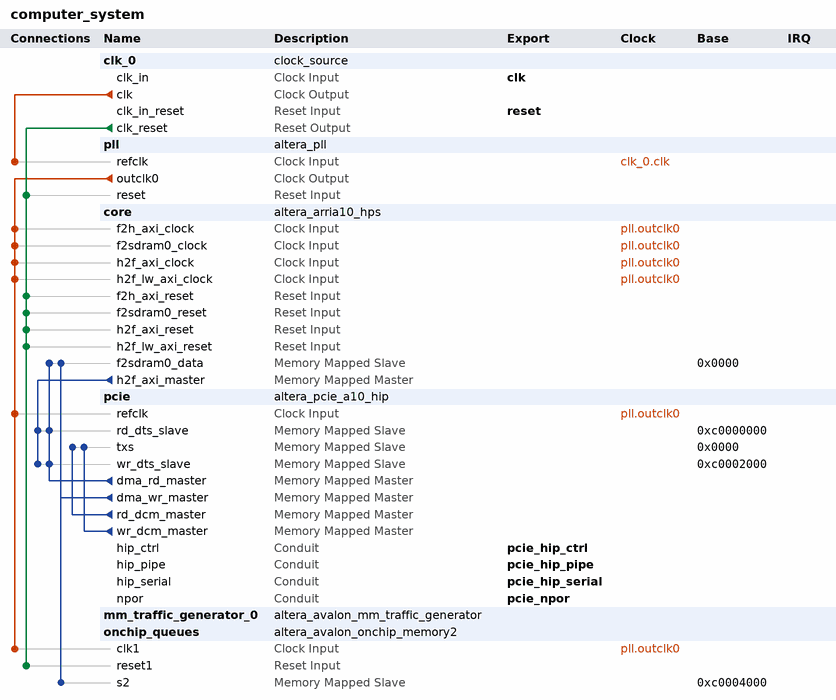
[diagram p0: system contents]
# Platform Designer (Qsys) system computer_system, Cyclone V 5CEBA2F17A7
# Parameters at their usual value, and those the tool derives, are not listed.
package require -exact qsys 21.1
create_system computer_system
set_project_property DEVICE_FAMILY {Cyclone V}
set_project_property DEVICE 5CEBA2F17A7

add_instance clk_0 clock_source 21.1
set_instance_parameter_value clk_0 clockFrequency 50000000

add_instance pll altera_pll 21.1
set_instance_parameter_value pll gui_device_speed_grade 1
set_instance_parameter_value pll gui_number_of_clocks 1
set_instance_parameter_value pll gui_operation_mode direct
set_instance_parameter_value pll gui_output_clock_frequency0 250.0
set_instance_parameter_value pll gui_pll_mode {Integer-N PLL}
set_instance_parameter_value pll gui_reference_clock_frequency 50.0
set_instance_parameter_value pll gui_use_locked false

add_instance core altera_arria10_hps 21.1
set_instance_parameter_value core BOOT_FROM_FPGA_Enable false
set_instance_parameter_value core BSEL 1
set_instance_parameter_value core BSEL_EN false
set_instance_parameter_value core CLK_EMACA_SOURCE 1
set_instance_parameter_value core CLK_EMACB_SOURCE 1
set_instance_parameter_value core CLK_EMAC_PTP_SOURCE 1
set_instance_parameter_value core CLK_GPIO_SOURCE 1
set_instance_parameter_value core CLK_HMC_PLL_SOURCE 0
set_instance_parameter_value core CLK_MAIN_PLL_SOURCE2 0
set_instance_parameter_value core CLK_MPU_CNT 0
set_instance_parameter_value core CLK_MPU_SOURCE 0
set_instance_parameter_value core CLK_NOC_CNT 0
set_instance_parameter_value core CLK_NOC_SOURCE 0
set_instance_parameter_value core CLK_PERI_PLL_SOURCE2 0
set_instance_parameter_value core CLK_S2F_USER0_SOURCE 0
set_instance_parameter_value core CLK_S2F_USER1_SOURCE 0
set_instance_parameter_value core CLK_SDMMC_SOURCE 0
set_instance_parameter_value core CM_Mode N/A
set_instance_parameter_value core CM_PinMuxing Unused
set_instance_parameter_value core CTI_Enable false
set_instance_parameter_value core CUSTOM_MPU_CLK 800
set_instance_parameter_value core DEBUG_APB_Enable false
set_instance_parameter_value core DISABLE_PERI_PLL false
set_instance_parameter_value core DMA_Enable No,No,No,No,No,No,No,No
set_instance_parameter_value core EMAC0_CLK 250
set_instance_parameter_value core EMAC0_Mode N/A
set_instance_parameter_value core EMAC0_PTP false
set_instance_parameter_value core EMAC0_PinMuxing Unused
set_instance_parameter_value core EMAC0_SWITCH_Enable false
set_instance_parameter_value core EMAC1_CLK 250
set_instance_parameter_value core EMAC1_Mode N/A
set_instance_parameter_value core EMAC1_PTP false
set_instance_parameter_value core EMAC1_PinMuxing Unused
set_instance_parameter_value core EMAC1_SWITCH_Enable false
set_instance_parameter_value core EMAC2_CLK 250
set_instance_parameter_value core EMAC2_Mode N/A
set_instance_parameter_value core EMAC2_PTP false
set_instance_parameter_value core EMAC2_PinMuxing Unused
set_instance_parameter_value core EMAC2_SWITCH_Enable false
set_instance_parameter_value core EMAC_PTP_REF_CLK 100
set_instance_parameter_value core EMIF_BYPASS_CHECK false
set_instance_parameter_value core EMIF_CONDUIT_Enable true
set_instance_parameter_value core F2H_AXI_CLOCK_FREQ 250000000
set_instance_parameter_value core F2H_COLD_RST_Enable false
set_instance_parameter_value core F2H_DBG_RST_Enable false
set_instance_parameter_value core F2H_FREE_CLK_Enable false
set_instance_parameter_value core F2H_FREE_CLK_FREQ 200
set_instance_parameter_value core F2H_SDRAM0_CLOCK_FREQ 100
set_instance_parameter_value core F2H_SDRAM1_CLOCK_FREQ 100
set_instance_parameter_value core F2H_SDRAM2_CLOCK_FREQ 100
set_instance_parameter_value core F2H_SDRAM3_CLOCK_FREQ 100
set_instance_parameter_value core F2H_SDRAM4_CLOCK_FREQ 100
set_instance_parameter_value core F2H_SDRAM5_CLOCK_FREQ 100
set_instance_parameter_value core F2H_WARM_RST_Enable false
set_instance_parameter_value core F2SDRAM0_ENABLED true
set_instance_parameter_value core F2SDRAM1_ENABLED false
set_instance_parameter_value core F2SDRAM2_DELAY 4
set_instance_parameter_value core F2SDRAM2_ENABLED false
set_instance_parameter_value core F2SDRAM_ADDRESS_WIDTH 32
set_instance_parameter_value core F2SDRAM_PORT_CONFIG 5
set_instance_parameter_value core F2SDRAM_READY_LATENCY true
set_instance_parameter_value core F2SINTERRUPT_Enable true
set_instance_parameter_value core F2S_Width 5
set_instance_parameter_value core FPGA_PERIPHERAL_INPUT_CLOCK_FREQ_EMAC0_RX_CLK_IN 100
set_instance_parameter_value core FPGA_PERIPHERAL_INPUT_CLOCK_FREQ_EMAC0_TX_CLK_IN 100
set_instance_parameter_value core FPGA_PERIPHERAL_INPUT_CLOCK_FREQ_EMAC1_RX_CLK_IN 100
set_instance_parameter_value core FPGA_PERIPHERAL_INPUT_CLOCK_FREQ_EMAC1_TX_CLK_IN 100
set_instance_parameter_value core FPGA_PERIPHERAL_INPUT_CLOCK_FREQ_EMAC2_RX_CLK_IN 100
set_instance_parameter_value core FPGA_PERIPHERAL_INPUT_CLOCK_FREQ_EMAC2_TX_CLK_IN 100
set_instance_parameter_value core FPGA_PERIPHERAL_INPUT_CLOCK_FREQ_EMAC_PTP_REF_CLOCK 100
set_instance_parameter_value core FPGA_PERIPHERAL_INPUT_CLOCK_FREQ_I2C0_SCL_IN 100
set_instance_parameter_value core FPGA_PERIPHERAL_INPUT_CLOCK_FREQ_I2C1_SCL_IN 100
set_instance_parameter_value core FPGA_PERIPHERAL_INPUT_CLOCK_FREQ_I2CEMAC0_SCL_IN 100
set_instance_parameter_value core FPGA_PERIPHERAL_INPUT_CLOCK_FREQ_I2CEMAC1_SCL_IN 100
set_instance_parameter_value core FPGA_PERIPHERAL_INPUT_CLOCK_FREQ_I2CEMAC2_SCL_IN 100
set_instance_parameter_value core FPGA_PERIPHERAL_INPUT_CLOCK_FREQ_SDMMC_CLK_IN 100
set_instance_parameter_value core FPGA_PERIPHERAL_INPUT_CLOCK_FREQ_SPIS0_SCLK_IN 100
set_instance_parameter_value core FPGA_PERIPHERAL_INPUT_CLOCK_FREQ_SPIS1_SCLK_IN 100
set_instance_parameter_value core FPGA_PERIPHERAL_INPUT_CLOCK_FREQ_USB0_CLK_IN 100
set_instance_parameter_value core FPGA_PERIPHERAL_INPUT_CLOCK_FREQ_USB1_CLK_IN 100
set_instance_parameter_value core FPGA_PERIPHERAL_OUTPUT_CLOCK_FREQ_EMAC0_GTX_CLK 100
set_instance_parameter_value core FPGA_PERIPHERAL_OUTPUT_CLOCK_FREQ_EMAC0_MD_CLK 2.5
set_instance_parameter_value core FPGA_PERIPHERAL_OUTPUT_CLOCK_FREQ_EMAC1_GTX_CLK 100
set_instance_parameter_value core FPGA_PERIPHERAL_OUTPUT_CLOCK_FREQ_EMAC1_MD_CLK 2.5
set_instance_parameter_value core FPGA_PERIPHERAL_OUTPUT_CLOCK_FREQ_EMAC2_GTX_CLK 100
set_instance_parameter_value core FPGA_PERIPHERAL_OUTPUT_CLOCK_FREQ_EMAC2_MD_CLK 2.5
set_instance_parameter_value core FPGA_PERIPHERAL_OUTPUT_CLOCK_FREQ_I2C0_CLK 100
set_instance_parameter_value core FPGA_PERIPHERAL_OUTPUT_CLOCK_FREQ_I2C1_CLK 100
set_instance_parameter_value core FPGA_PERIPHERAL_OUTPUT_CLOCK_FREQ_I2CEMAC0_CLK 100
set_instance_parameter_value core FPGA_PERIPHERAL_OUTPUT_CLOCK_FREQ_I2CEMAC1_CLK 100
set_instance_parameter_value core FPGA_PERIPHERAL_OUTPUT_CLOCK_FREQ_I2CEMAC2_CLK 100
set_instance_parameter_value core FPGA_PERIPHERAL_OUTPUT_CLOCK_FREQ_QSPI_SCLK_OUT 100
set_instance_parameter_value core FPGA_PERIPHERAL_OUTPUT_CLOCK_FREQ_SDMMC_CCLK 100
set_instance_parameter_value core FPGA_PERIPHERAL_OUTPUT_CLOCK_FREQ_SPIM0_SCLK_OUT 100
set_instance_parameter_value core FPGA_PERIPHERAL_OUTPUT_CLOCK_FREQ_SPIM1_SCLK_OUT 100
set_instance_parameter_value core GPIO_REF_CLK 4
set_instance_parameter_value core GP_Enable false
set_instance_parameter_value core H2F_AXI_CLOCK_FREQ 250000000
set_instance_parameter_value core H2F_COLD_RST_Enable false
set_instance_parameter_value core H2F_CTI_CLOCK_FREQ 100
set_instance_parameter_value core H2F_DEBUG_APB_CLOCK_FREQ 100
set_instance_parameter_value core H2F_LW_AXI_CLOCK_FREQ 250000000
set_instance_parameter_value core H2F_PENDING_RST_Enable false
set_instance_parameter_value core H2F_TPIU_CLOCK_IN_FREQ 100
set_instance_parameter_value core H2F_USER0_CLK_Enable false
set_instance_parameter_value core H2F_USER0_CLK_FREQ 400
set_instance_parameter_value core H2F_USER1_CLK_Enable false
set_instance_parameter_value core H2F_USER1_CLK_FREQ 400
set_instance_parameter_value core HMC_PLL_REF_CLK 800
set_instance_parameter_value core HPS_DIV_GPIO_FREQ 125
set_instance_parameter_value core HPS_IO_Enable unused,unused,unused,unused,unused,unused,unused,unused,unused,unused,unused,unused,unused,unused,unused,unused,unused,unused,unused,unused,unused,unused,unused,unused,unused,unused,unused,unused,unused,unused,unused,unused,unused,unused,unused,unused,unused,unused,unused,unused,unused,unused,unused,unused,unused,unused,unused,unused,unused,unused,unused,unused,unused,unused,unused,unused,unused,unused,unused,unused,unused,unused
set_instance_parameter_value core I2C0_Mode N/A
set_instance_parameter_value core I2C0_PinMuxing Unused
set_instance_parameter_value core I2C1_Mode N/A
set_instance_parameter_value core I2C1_PinMuxing Unused
set_instance_parameter_value core I2CEMAC0_Mode N/A
set_instance_parameter_value core I2CEMAC0_PinMuxing Unused
set_instance_parameter_value core I2CEMAC1_Mode N/A
set_instance_parameter_value core I2CEMAC1_PinMuxing Unused
set_instance_parameter_value core I2CEMAC2_Mode N/A
set_instance_parameter_value core I2CEMAC2_PinMuxing Unused
set_instance_parameter_value core INTERNAL_OSCILLATOR_ENABLE 60
set_instance_parameter_value core JTAG_Enable false
set_instance_parameter_value core L3_MAIN_FREE_CLK 400
set_instance_parameter_value core L4_SYS_FREE_CLK 1
set_instance_parameter_value core LWH2F_Enable 2
set_instance_parameter_value core MPU_CLK_VCCL 0
set_instance_parameter_value core MPU_EVENTS_Enable true
set_instance_parameter_value core NAND_Mode N/A
set_instance_parameter_value core NAND_PinMuxing Unused
set_instance_parameter_value core NOCDIV_CS_ATCLK 0
set_instance_parameter_value core NOCDIV_CS_PDBGCLK 1
set_instance_parameter_value core NOCDIV_CS_TRACECLK 0
set_instance_parameter_value core NOCDIV_L4MAINCLK 0
set_instance_parameter_value core NOCDIV_L4MPCLK 1
set_instance_parameter_value core NOCDIV_L4SPCLK 2
set_instance_parameter_value core OVERIDE_PERI_PLL false
set_instance_parameter_value core PERI_PLL_MANUAL_VCO_FREQ 2000
set_instance_parameter_value core PLL_CLK0 Unused
set_instance_parameter_value core PLL_CLK1 Unused
set_instance_parameter_value core PLL_CLK2 Unused
set_instance_parameter_value core PLL_CLK3 Unused
set_instance_parameter_value core PLL_CLK4 Unused
set_instance_parameter_value core QSPI_Mode N/A
set_instance_parameter_value core QSPI_PinMuxing Unused
set_instance_parameter_value core RUN_INTERNAL_BUILD_CHECKS 0
set_instance_parameter_value core S2FINTERRUPT_CLOCKPERIPHERAL_Enable false
set_instance_parameter_value core S2FINTERRUPT_CTI_Enable false
set_instance_parameter_value core S2FINTERRUPT_DMA_Enable false
set_instance_parameter_value core S2FINTERRUPT_EMAC0_Enable false
set_instance_parameter_value core S2FINTERRUPT_EMAC1_Enable false
set_instance_parameter_value core S2FINTERRUPT_EMAC2_Enable false
set_instance_parameter_value core S2FINTERRUPT_FPGAMANAGER_Enable false
set_instance_parameter_value core S2FINTERRUPT_GPIO_Enable false
set_instance_parameter_value core S2FINTERRUPT_HMC_Enable false
set_instance_parameter_value core S2FINTERRUPT_I2C0_Enable false
set_instance_parameter_value core S2FINTERRUPT_I2C1_Enable false
set_instance_parameter_value core S2FINTERRUPT_I2CEMAC0_Enable false
set_instance_parameter_value core S2FINTERRUPT_I2CEMAC1_Enable false
set_instance_parameter_value core S2FINTERRUPT_I2CEMAC2_Enable false
set_instance_parameter_value core S2FINTERRUPT_L4TIMER_Enable false
set_instance_parameter_value core S2FINTERRUPT_NAND_Enable false
set_instance_parameter_value core S2FINTERRUPT_QSPI_Enable false
set_instance_parameter_value core S2FINTERRUPT_SDMMC_Enable false
set_instance_parameter_value core S2FINTERRUPT_SPIM0_Enable false
set_instance_parameter_value core S2FINTERRUPT_SPIM1_Enable false
set_instance_parameter_value core S2FINTERRUPT_SPIS0_Enable false
set_instance_parameter_value core S2FINTERRUPT_SPIS1_Enable false
set_instance_parameter_value core S2FINTERRUPT_SYSTEMMANAGER_Enable false
set_instance_parameter_value core S2FINTERRUPT_SYSTIMER_Enable false
set_instance_parameter_value core S2FINTERRUPT_UART0_Enable false
set_instance_parameter_value core S2FINTERRUPT_UART1_Enable false
set_instance_parameter_value core S2FINTERRUPT_USB0_Enable false
set_instance_parameter_value core S2FINTERRUPT_USB1_Enable false
set_instance_parameter_value core S2FINTERRUPT_WATCHDOG_Enable false
set_instance_parameter_value core S2F_Width 5
set_instance_parameter_value core SDMMC_Mode N/A
set_instance_parameter_value core SDMMC_PinMuxing Unused
set_instance_parameter_value core SDMMC_REF_CLK 200
set_instance_parameter_value core SECURITY_MODULE_Enable false
set_instance_parameter_value core SPIM0_Mode N/A
set_instance_parameter_value core SPIM0_PinMuxing Unused
set_instance_parameter_value core SPIM1_Mode N/A
set_instance_parameter_value core SPIM1_PinMuxing Unused
set_instance_parameter_value core SPIS0_Mode N/A
set_instance_parameter_value core SPIS0_PinMuxing Unused
set_instance_parameter_value core SPIS1_Mode N/A
set_instance_parameter_value core SPIS1_PinMuxing Unused
set_instance_parameter_value core STM_Enable false
set_instance_parameter_value core TESTIOCTRL_DEBUGCLKSEL 16
set_instance_parameter_value core TESTIOCTRL_MAINCLKSEL 8
set_instance_parameter_value core TESTIOCTRL_PERICLKSEL 8
set_instance_parameter_value core TEST_Enable false
set_instance_parameter_value core TRACE_Mode N/A
set_instance_parameter_value core TRACE_PinMuxing Unused
set_instance_parameter_value core UART0_Mode N/A
set_instance_parameter_value core UART0_PinMuxing Unused
set_instance_parameter_value core UART1_Mode N/A
set_instance_parameter_value core UART1_PinMuxing Unused
set_instance_parameter_value core USB0_Mode N/A
set_instance_parameter_value core USB0_PinMuxing Unused
set_instance_parameter_value core USB1_Mode N/A
set_instance_parameter_value core USB1_PinMuxing Unused
set_instance_parameter_value core USE_DEFAULT_MPU_CLK false
set_instance_parameter_value core device_name 5CEBA2F17A7
set_instance_parameter_value core eosc1_clk_mhz 25.0
set_instance_parameter_value core quartus_ini_hps_ip_boot_from_fpga_ready false
set_instance_parameter_value core quartus_ini_hps_ip_enable_a10_advanced_options false
set_instance_parameter_value core quartus_ini_hps_ip_enable_jtag false
set_instance_parameter_value core quartus_ini_hps_ip_enable_sdmmc_clk_in false
set_instance_parameter_value core quartus_ini_hps_ip_enable_test_interface false
set_instance_parameter_value core quartus_ini_hps_ip_overide_f2sdram_delay false
set_instance_parameter_value core quartus_ini_hps_ip_override_sdmmc_4bit false

add_instance pcie altera_pcie_a10_hip 21.1
set_instance_parameter_value pcie adme_enable_hwtcl 0
set_instance_parameter_value pcie advance_error_reporting_hwtcl 0
set_instance_parameter_value pcie apps_type_hwtcl 0
set_instance_parameter_value pcie ari_support_hwtcl 0
set_instance_parameter_value pcie ast_trs_num_desc_hwtcl 16
set_instance_parameter_value pcie ast_trs_rxdata_width_hwtcl 256
set_instance_parameter_value pcie ast_trs_rxdesc_width_hwtcl 256
set_instance_parameter_value pcie ast_trs_rxmty_width_hwtcl 32
set_instance_parameter_value pcie ast_trs_txdata_width_hwtcl 256
set_instance_parameter_value pcie ast_trs_txdesc_width_hwtcl 256
set_instance_parameter_value pcie ast_trs_txmty_width_hwtcl 32
set_instance_parameter_value pcie ast_trs_txstatus_width_hwtcl 256
set_instance_parameter_value pcie avmm_addr_width_hwtcl 64
set_instance_parameter_value pcie bar0_address_width_hwtcl 16
set_instance_parameter_value pcie bar0_type_hwtcl {64-bit prefetchable memory}
set_instance_parameter_value pcie bar1_address_width_hwtcl 0
set_instance_parameter_value pcie bar1_type_hwtcl Disabled
set_instance_parameter_value pcie bar2_address_width_hwtcl 8
set_instance_parameter_value pcie bar2_type_hwtcl Disabled
set_instance_parameter_value pcie bar3_address_width_hwtcl 0
set_instance_parameter_value pcie bar3_type_hwtcl Disabled
set_instance_parameter_value pcie base_device CYCLONEV_E50F
set_instance_parameter_value pcie bfm_drive_interface_clk_hwtcl 1
set_instance_parameter_value pcie bfm_drive_interface_control_hwtcl 1
set_instance_parameter_value pcie bfm_drive_interface_npor_hwtcl 1
set_instance_parameter_value pcie bfm_drive_interface_pipe_hwtcl 1
set_instance_parameter_value pcie cg_a2p_addr_map_pass_thru_bits_hwtcl 12
set_instance_parameter_value pcie cg_enable_a2p_interrupt_hwtcl 0
set_instance_parameter_value pcie cg_enable_advanced_interrupt_hwtcl 0
set_instance_parameter_value pcie cg_impl_cra_av_slave_port_hwtcl 0
set_instance_parameter_value pcie class_code_hwtcl 16711680
set_instance_parameter_value pcie completion_timeout_hwtcl NONE
set_instance_parameter_value pcie cseb_autonomous_hwtcl 0
set_instance_parameter_value pcie cseb_config_bypass_gui_hwtcl 0
set_instance_parameter_value pcie design_environment_hwtcl QSYS
set_instance_parameter_value pcie devhide_support_hwtcl 0
set_instance_parameter_value pcie device_embedded_ep_support_hwtcl 0
set_instance_parameter_value pcie device_family {Cyclone V}
set_instance_parameter_value pcie device_id_hwtcl 0
set_instance_parameter_value pcie dis_adapt 0
set_instance_parameter_value pcie dma_use_scfifo_ext_hwtcl 0
set_instance_parameter_value pcie eco_fb332688_dis_hwtcl 0
set_instance_parameter_value pcie ecrc_check_capable_hwtcl 0
set_instance_parameter_value pcie ecrc_gen_capable_hwtcl 0
set_instance_parameter_value pcie enable_alternate_link_list_hwtcl 0
set_instance_parameter_value pcie enable_ast_trs_hwtcl 0
set_instance_parameter_value pcie enable_avst_reset_hwtcl 1
set_instance_parameter_value pcie enable_custom_features_hwtcl 0
set_instance_parameter_value pcie enable_devkit_conduit_hwtcl 0
set_instance_parameter_value pcie enable_example_design_qii_hwtcl 1
set_instance_parameter_value pcie enable_example_design_sim_hwtcl 1
set_instance_parameter_value pcie enable_example_design_synth_hwtcl 1
set_instance_parameter_value pcie enable_example_design_tb_hwtcl 1
set_instance_parameter_value pcie enable_g3_bypass_equlz_rp_sim_hwtcl 0
set_instance_parameter_value pcie enable_gen3phase2eq_timechange 0
set_instance_parameter_value pcie enable_hip_status_for_avmm_hwtcl 0
set_instance_parameter_value pcie enable_lmi_hwtcl 0
set_instance_parameter_value pcie enable_nobar_slection_hwtcl 0
set_instance_parameter_value pcie enable_rxm_burst_hwtcl 0
set_instance_parameter_value pcie enable_skp_det 0
set_instance_parameter_value pcie enable_soft_dfe 0
set_instance_parameter_value pcie export_fpll_output_to_top_level_hwtcl 0
set_instance_parameter_value pcie export_phy_input_to_top_level_hwtcl 0
set_instance_parameter_value pcie extended_tag_support_hwtcl 0
set_instance_parameter_value pcie flr_capability_user_hwtcl 0
set_instance_parameter_value pcie force_tag_checking_on_hwtcl 0
set_instance_parameter_value pcie gen3_coeff_1_hwtcl 8
set_instance_parameter_value pcie gen3_coeff_3_ber_meas_hwtcl 12ms
set_instance_parameter_value pcie include_virtio_capabilities_hwtcl 0
set_instance_parameter_value pcie interface_type_hwtcl {Avalon-MM with DMA}
set_instance_parameter_value pcie internal_controller_hwtcl 1
set_instance_parameter_value pcie link2csr_width_hwtcl 16
set_instance_parameter_value pcie maximum_payload_size_hwtcl 256
set_instance_parameter_value pcie part_trait_device 5CEBA2F17A7
set_instance_parameter_value pcie pf0_ats_invalidate_queue_depth_hwtcl 0
set_instance_parameter_value pcie pf0_bar0_prefetchable_hwtcl 1
set_instance_parameter_value pcie pf0_bar0_present_hwtcl 1
set_instance_parameter_value pcie pf0_bar0_size_hwtcl 12
set_instance_parameter_value pcie pf0_bar0_type_hwtcl 1
set_instance_parameter_value pcie pf0_bar1_prefetchable_hwtcl 1
set_instance_parameter_value pcie pf0_bar1_present_hwtcl 0
set_instance_parameter_value pcie pf0_bar1_size_hwtcl 12
set_instance_parameter_value pcie pf0_bar2_prefetchable_hwtcl 1
set_instance_parameter_value pcie pf0_bar2_present_hwtcl 0
set_instance_parameter_value pcie pf0_bar2_size_hwtcl 12
set_instance_parameter_value pcie pf0_bar2_type_hwtcl 1
set_instance_parameter_value pcie pf0_bar3_prefetchable_hwtcl 1
set_instance_parameter_value pcie pf0_bar3_present_hwtcl 0
set_instance_parameter_value pcie pf0_bar3_size_hwtcl 12
set_instance_parameter_value pcie pf0_bar4_prefetchable_hwtcl 1
set_instance_parameter_value pcie pf0_bar4_present_hwtcl 0
set_instance_parameter_value pcie pf0_bar4_size_hwtcl 12
set_instance_parameter_value pcie pf0_bar4_type_hwtcl 1
set_instance_parameter_value pcie pf0_bar5_prefetchable_hwtcl 1
set_instance_parameter_value pcie pf0_bar5_present_hwtcl 0
set_instance_parameter_value pcie pf0_bar5_size_hwtcl 12
set_instance_parameter_value pcie pf0_exprom_bar_present_hwtcl 0
set_instance_parameter_value pcie pf0_exprom_bar_size_hwtcl 12
set_instance_parameter_value pcie pf0_extra_bar_present_hwtcl 0
set_instance_parameter_value pcie pf0_extra_bar_size_hwtcl 12
set_instance_parameter_value pcie pf0_interrupt_pin_hwtcl inta
set_instance_parameter_value pcie pf0_intr_line_hwtcl 0
set_instance_parameter_value pcie pf0_msi_multi_message_capable_hwtcl 4
set_instance_parameter_value pcie pf0_msix_pba_bir_hwtcl 0
set_instance_parameter_value pcie pf0_msix_pba_offset_hwtcl 0
set_instance_parameter_value pcie pf0_msix_table_bir_hwtcl 0
set_instance_parameter_value pcie pf0_msix_table_offset_hwtcl 0
set_instance_parameter_value pcie pf0_msix_table_size_hwtcl 0
set_instance_parameter_value pcie pf0_pci_prog_intfc_byte_hwtcl 0
set_instance_parameter_value pcie pf0_subclass_code_hwtcl 0
set_instance_parameter_value pcie pf0_tph_dev_specific_mode_support_hwtcl 0
set_instance_parameter_value pcie pf0_tph_int_mode_support_hwtcl 0
set_instance_parameter_value pcie pf0_tph_st_table_location_hwtcl 0
set_instance_parameter_value pcie pf0_tph_st_table_size_hwtcl 63
set_instance_parameter_value pcie pf0_vf_bar0_prefetchable_hwtcl 1
set_instance_parameter_value pcie pf0_vf_bar0_present_hwtcl 0
set_instance_parameter_value pcie pf0_vf_bar0_size_hwtcl 12
set_instance_parameter_value pcie pf0_vf_bar0_type_hwtcl 1
set_instance_parameter_value pcie pf0_vf_bar1_prefetchable_hwtcl 1
set_instance_parameter_value pcie pf0_vf_bar1_present_hwtcl 0
set_instance_parameter_value pcie pf0_vf_bar1_size_hwtcl 12
set_instance_parameter_value pcie pf0_vf_bar2_prefetchable_hwtcl 1
set_instance_parameter_value pcie pf0_vf_bar2_present_hwtcl 0
set_instance_parameter_value pcie pf0_vf_bar2_size_hwtcl 12
set_instance_parameter_value pcie pf0_vf_bar2_type_hwtcl 1
set_instance_parameter_value pcie pf0_vf_bar3_prefetchable_hwtcl 1
set_instance_parameter_value pcie pf0_vf_bar3_present_hwtcl 0
set_instance_parameter_value pcie pf0_vf_bar3_size_hwtcl 12
set_instance_parameter_value pcie pf0_vf_bar4_prefetchable_hwtcl 1
set_instance_parameter_value pcie pf0_vf_bar4_present_hwtcl 0
set_instance_parameter_value pcie pf0_vf_bar4_size_hwtcl 12
set_instance_parameter_value pcie pf0_vf_bar4_type_hwtcl 1
set_instance_parameter_value pcie pf0_vf_bar5_prefetchable_hwtcl 1
set_instance_parameter_value pcie pf0_vf_bar5_present_hwtcl 0
set_instance_parameter_value pcie pf0_vf_bar5_size_hwtcl 12
set_instance_parameter_value pcie pf0_vf_count_user_hwtcl 0
set_instance_parameter_value pcie pf0_vf_device_id_hwtcl 0
set_instance_parameter_value pcie pf0_vf_msix_pba_bir_hwtcl 0
set_instance_parameter_value pcie pf0_vf_msix_pba_offset_hwtcl 0
set_instance_parameter_value pcie pf0_vf_msix_tbl_bir_hwtcl 0
set_instance_parameter_value pcie pf0_vf_msix_tbl_offset_hwtcl 0
set_instance_parameter_value pcie pf0_vf_msix_tbl_size_hwtcl 0
set_instance_parameter_value pcie pf0_vf_subsystem_device_id_hwtcl 0
set_instance_parameter_value pcie pf0_vf_tph_dev_specific_mode_support_hwtcl 0
set_instance_parameter_value pcie pf0_vf_tph_int_mode_support_hwtcl 0
set_instance_parameter_value pcie pf0_vf_tph_st_table_location_hwtcl 0
set_instance_parameter_value pcie pf0_vf_tph_st_table_size_hwtcl 63
set_instance_parameter_value pcie pf0_virtio_capability_present_hwtcl 0
set_instance_parameter_value pcie pf0_virtio_cmn_config_bar_indicator_hwtcl 0
set_instance_parameter_value pcie pf0_virtio_cmn_config_bar_offset_hwtcl 0
set_instance_parameter_value pcie pf0_virtio_cmn_config_structure_length_hwtcl 0
set_instance_parameter_value pcie pf0_virtio_device_specific_cap_present_hwtcl 0
set_instance_parameter_value pcie pf0_virtio_devspecific_bar_indicator_hwtcl 0
set_instance_parameter_value pcie pf0_virtio_devspecific_bar_offset_hwtcl 0
set_instance_parameter_value pcie pf0_virtio_devspecific_structure_length_hwtcl 0
set_instance_parameter_value pcie pf0_virtio_isrstatus_bar_indicator_hwtcl 0
set_instance_parameter_value pcie pf0_virtio_isrstatus_bar_offset_hwtcl 0
set_instance_parameter_value pcie pf0_virtio_isrstatus_structure_length_hwtcl 0
set_instance_parameter_value pcie pf0_virtio_notification_bar_indicator_hwtcl 0
set_instance_parameter_value pcie pf0_virtio_notification_bar_offset_hwtcl 0
set_instance_parameter_value pcie pf0_virtio_notification_structure_length_hwtcl 0
set_instance_parameter_value pcie pf0_virtio_notify_off_multiplier_hwtcl 0
set_instance_parameter_value pcie pf0_virtio_pciconfig_access_bar_indicator_hwtcl 0
set_instance_parameter_value pcie pf0_virtio_pciconfig_access_bar_offset_hwtcl 0
set_instance_parameter_value pcie pf0_virtio_pciconfig_access_structure_length_hwtcl 0
set_instance_parameter_value pcie pf0vf_virtio_capability_present_hwtcl 0
set_instance_parameter_value pcie pf0vf_virtio_cmn_config_bar_indicator_hwtcl 0
set_instance_parameter_value pcie pf0vf_virtio_cmn_config_bar_offset_hwtcl 0
set_instance_parameter_value pcie pf0vf_virtio_cmn_config_structure_length_hwtcl 0
set_instance_parameter_value pcie pf0vf_virtio_device_specific_cap_present_hwtcl 0
set_instance_parameter_value pcie pf0vf_virtio_devspecific_bar_indicator_hwtcl 0
set_instance_parameter_value pcie pf0vf_virtio_devspecific_bar_offset_hwtcl 0
set_instance_parameter_value pcie pf0vf_virtio_devspecific_structure_length_hwtcl 0
set_instance_parameter_value pcie pf0vf_virtio_isrstatus_bar_indicator_hwtcl 0
set_instance_parameter_value pcie pf0vf_virtio_isrstatus_bar_offset_hwtcl 0
set_instance_parameter_value pcie pf0vf_virtio_isrstatus_structure_length_hwtcl 0
set_instance_parameter_value pcie pf0vf_virtio_notification_bar_indicator_hwtcl 0
set_instance_parameter_value pcie pf0vf_virtio_notification_bar_offset_hwtcl 0
set_instance_parameter_value pcie pf0vf_virtio_notification_structure_length_hwtcl 0
set_instance_parameter_value pcie pf0vf_virtio_notify_off_multiplier_hwtcl 0
set_instance_parameter_value pcie pf0vf_virtio_pciconfig_access_bar_indicator_hwtcl 0
set_instance_parameter_value pcie pf0vf_virtio_pciconfig_access_bar_offset_hwtcl 0
set_instance_parameter_value pcie pf0vf_virtio_pciconfig_access_structure_length_hwtcl 0
set_instance_parameter_value pcie pf1_ats_invalidate_queue_depth_hwtcl 0
set_instance_parameter_value pcie pf1_bar0_prefetchable_hwtcl 1
set_instance_parameter_value pcie pf1_bar0_present_hwtcl 0
set_instance_parameter_value pcie pf1_bar0_size_hwtcl 12
set_instance_parameter_value pcie pf1_bar0_type_hwtcl 1
set_instance_parameter_value pcie pf1_bar1_prefetchable_hwtcl 1
set_instance_parameter_value pcie pf1_bar1_present_hwtcl 0
set_instance_parameter_value pcie pf1_bar1_size_hwtcl 12
set_instance_parameter_value pcie pf1_bar2_prefetchable_hwtcl 1
set_instance_parameter_value pcie pf1_bar2_present_hwtcl 0
set_instance_parameter_value pcie pf1_bar2_size_hwtcl 12
set_instance_parameter_value pcie pf1_bar2_type_hwtcl 1
set_instance_parameter_value pcie pf1_bar3_prefetchable_hwtcl 1
set_instance_parameter_value pcie pf1_bar3_present_hwtcl 0
set_instance_parameter_value pcie pf1_bar3_size_hwtcl 12
set_instance_parameter_value pcie pf1_bar4_prefetchable_hwtcl 1
set_instance_parameter_value pcie pf1_bar4_present_hwtcl 0
set_instance_parameter_value pcie pf1_bar4_size_hwtcl 12
set_instance_parameter_value pcie pf1_bar4_type_hwtcl 1
set_instance_parameter_value pcie pf1_bar5_prefetchable_hwtcl 1
set_instance_parameter_value pcie pf1_bar5_present_hwtcl 0
set_instance_parameter_value pcie pf1_bar5_size_hwtcl 12
set_instance_parameter_value pcie pf1_class_code_hwtcl 0
set_instance_parameter_value pcie pf1_device_id_hwtcl 0
set_instance_parameter_value pcie pf1_exprom_bar_present_hwtcl 0
set_instance_parameter_value pcie pf1_exprom_bar_size_hwtcl 12
set_instance_parameter_value pcie pf1_interrupt_pin_hwtcl inta
set_instance_parameter_value pcie pf1_intr_line_hwtcl 0
set_instance_parameter_value pcie pf1_msi_multi_message_capable_hwtcl 4
set_instance_parameter_value pcie pf1_msix_pba_bir_hwtcl 0
set_instance_parameter_value pcie pf1_msix_pba_offset_hwtcl 0
set_instance_parameter_value pcie pf1_msix_table_bir_hwtcl 0
set_instance_parameter_value pcie pf1_msix_table_offset_hwtcl 0
set_instance_parameter_value pcie pf1_msix_table_size_hwtcl 0
set_instance_parameter_value pcie pf1_pci_prog_intfc_byte_hwtcl 0
set_instance_parameter_value pcie pf1_revision_id_hwtcl 0
set_instance_parameter_value pcie pf1_subclass_code_hwtcl 0
set_instance_parameter_value pcie pf1_subsystem_device_id_hwtcl 0
set_instance_parameter_value pcie pf1_subsystem_vendor_id_hwtcl 0
set_instance_parameter_value pcie pf1_tph_dev_specific_mode_support_hwtcl 0
set_instance_parameter_value pcie pf1_tph_int_mode_support_hwtcl 0
set_instance_parameter_value pcie pf1_tph_st_table_location_hwtcl 0
set_instance_parameter_value pcie pf1_tph_st_table_size_hwtcl 63
set_instance_parameter_value pcie pf1_vendor_id_hwtcl 0
set_instance_parameter_value pcie pf1_vf_bar0_prefetchable_hwtcl 1
set_instance_parameter_value pcie pf1_vf_bar0_present_hwtcl 0
set_instance_parameter_value pcie pf1_vf_bar0_size_hwtcl 12
set_instance_parameter_value pcie pf1_vf_bar0_type_hwtcl 1
set_instance_parameter_value pcie pf1_vf_bar1_prefetchable_hwtcl 1
set_instance_parameter_value pcie pf1_vf_bar1_present_hwtcl 0
set_instance_parameter_value pcie pf1_vf_bar1_size_hwtcl 12
set_instance_parameter_value pcie pf1_vf_bar2_prefetchable_hwtcl 1
set_instance_parameter_value pcie pf1_vf_bar2_present_hwtcl 0
set_instance_parameter_value pcie pf1_vf_bar2_size_hwtcl 12
set_instance_parameter_value pcie pf1_vf_bar2_type_hwtcl 1
set_instance_parameter_value pcie pf1_vf_bar3_prefetchable_hwtcl 1
set_instance_parameter_value pcie pf1_vf_bar3_present_hwtcl 0
set_instance_parameter_value pcie pf1_vf_bar3_size_hwtcl 12
set_instance_parameter_value pcie pf1_vf_bar4_prefetchable_hwtcl 1
set_instance_parameter_value pcie pf1_vf_bar4_present_hwtcl 0
set_instance_parameter_value pcie pf1_vf_bar4_size_hwtcl 12
set_instance_parameter_value pcie pf1_vf_bar4_type_hwtcl 1
set_instance_parameter_value pcie pf1_vf_bar5_prefetchable_hwtcl 1
set_instance_parameter_value pcie pf1_vf_bar5_present_hwtcl 0
set_instance_parameter_value pcie pf1_vf_bar5_size_hwtcl 12
set_instance_parameter_value pcie pf1_vf_count_user_hwtcl 0
set_instance_parameter_value pcie pf1_vf_device_id_hwtcl 0
set_instance_parameter_value pcie pf1_vf_msix_pba_bir_hwtcl 0
set_instance_parameter_value pcie pf1_vf_msix_pba_offset_hwtcl 0
set_instance_parameter_value pcie pf1_vf_msix_tbl_bir_hwtcl 0
set_instance_parameter_value pcie pf1_vf_msix_tbl_offset_hwtcl 0
set_instance_parameter_value pcie pf1_vf_msix_tbl_size_hwtcl 0
set_instance_parameter_value pcie pf1_vf_subsystem_device_id_hwtcl 0
set_instance_parameter_value pcie pf1_vf_tph_dev_specific_mode_support_hwtcl 0
set_instance_parameter_value pcie pf1_vf_tph_int_mode_support_hwtcl 0
set_instance_parameter_value pcie pf1_vf_tph_st_table_location_hwtcl 0
set_instance_parameter_value pcie pf1_vf_tph_st_table_size_hwtcl 63
set_instance_parameter_value pcie pf1_virtio_capability_present_hwtcl 0
set_instance_parameter_value pcie pf1_virtio_cmn_config_bar_indicator_hwtcl 0
set_instance_parameter_value pcie pf1_virtio_cmn_config_bar_offset_hwtcl 0
set_instance_parameter_value pcie pf1_virtio_cmn_config_structure_length_hwtcl 0
set_instance_parameter_value pcie pf1_virtio_device_specific_cap_present_hwtcl 0
set_instance_parameter_value pcie pf1_virtio_devspecific_bar_indicator_hwtcl 0
set_instance_parameter_value pcie pf1_virtio_devspecific_bar_offset_hwtcl 0
set_instance_parameter_value pcie pf1_virtio_devspecific_structure_length_hwtcl 0
set_instance_parameter_value pcie pf1_virtio_isrstatus_bar_indicator_hwtcl 0
set_instance_parameter_value pcie pf1_virtio_isrstatus_bar_offset_hwtcl 0
set_instance_parameter_value pcie pf1_virtio_isrstatus_structure_length_hwtcl 0
set_instance_parameter_value pcie pf1_virtio_notification_bar_indicator_hwtcl 0
set_instance_parameter_value pcie pf1_virtio_notification_bar_offset_hwtcl 0
set_instance_parameter_value pcie pf1_virtio_notification_structure_length_hwtcl 0
set_instance_parameter_value pcie pf1_virtio_notify_off_multiplier_hwtcl 0
set_instance_parameter_value pcie pf1_virtio_pciconfig_access_bar_indicator_hwtcl 0
set_instance_parameter_value pcie pf1_virtio_pciconfig_access_bar_offset_hwtcl 0
set_instance_parameter_value pcie pf1_virtio_pciconfig_access_structure_length_hwtcl 0
set_instance_parameter_value pcie pf1vf_virtio_capability_present_hwtcl 0
set_instance_parameter_value pcie pf1vf_virtio_cmn_config_bar_indicator_hwtcl 0
set_instance_parameter_value pcie pf1vf_virtio_cmn_config_bar_offset_hwtcl 0
set_instance_parameter_value pcie pf1vf_virtio_cmn_config_structure_length_hwtcl 0
set_instance_parameter_value pcie pf1vf_virtio_device_specific_cap_present_hwtcl 0
set_instance_parameter_value pcie pf1vf_virtio_devspecific_bar_indicator_hwtcl 0
set_instance_parameter_value pcie pf1vf_virtio_devspecific_bar_offset_hwtcl 0
set_instance_parameter_value pcie pf1vf_virtio_devspecific_structure_length_hwtcl 0
set_instance_parameter_value pcie pf1vf_virtio_isrstatus_bar_indicator_hwtcl 0
set_instance_parameter_value pcie pf1vf_virtio_isrstatus_bar_offset_hwtcl 0
set_instance_parameter_value pcie pf1vf_virtio_isrstatus_structure_length_hwtcl 0
set_instance_parameter_value pcie pf1vf_virtio_notification_bar_indicator_hwtcl 0
set_instance_parameter_value pcie pf1vf_virtio_notification_bar_offset_hwtcl 0
set_instance_parameter_value pcie pf1vf_virtio_notification_structure_length_hwtcl 0
set_instance_parameter_value pcie pf1vf_virtio_notify_off_multiplier_hwtcl 0
set_instance_parameter_value pcie pf1vf_virtio_pciconfig_access_bar_indicator_hwtcl 0
set_instance_parameter_value pcie pf1vf_virtio_pciconfig_access_bar_offset_hwtcl 0
set_instance_parameter_value pcie pf1vf_virtio_pciconfig_access_structure_length_hwtcl 0
set_instance_parameter_value pcie pf2_ats_invalidate_queue_depth_hwtcl 0
set_instance_parameter_value pcie pf2_bar0_prefetchable_hwtcl 1
set_instance_parameter_value pcie pf2_bar0_present_hwtcl 0
set_instance_parameter_value pcie pf2_bar0_size_hwtcl 12
set_instance_parameter_value pcie pf2_bar0_type_hwtcl 1
set_instance_parameter_value pcie pf2_bar1_prefetchable_hwtcl 1
set_instance_parameter_value pcie pf2_bar1_present_hwtcl 0
set_instance_parameter_value pcie pf2_bar1_size_hwtcl 12
set_instance_parameter_value pcie pf2_bar2_prefetchable_hwtcl 1
set_instance_parameter_value pcie pf2_bar2_present_hwtcl 0
set_instance_parameter_value pcie pf2_bar2_size_hwtcl 12
set_instance_parameter_value pcie pf2_bar2_type_hwtcl 1
set_instance_parameter_value pcie pf2_bar3_prefetchable_hwtcl 1
set_instance_parameter_value pcie pf2_bar3_present_hwtcl 0
set_instance_parameter_value pcie pf2_bar3_size_hwtcl 12
set_instance_parameter_value pcie pf2_bar4_prefetchable_hwtcl 1
set_instance_parameter_value pcie pf2_bar4_present_hwtcl 0
set_instance_parameter_value pcie pf2_bar4_size_hwtcl 12
set_instance_parameter_value pcie pf2_bar4_type_hwtcl 1
set_instance_parameter_value pcie pf2_bar5_prefetchable_hwtcl 1
set_instance_parameter_value pcie pf2_bar5_present_hwtcl 0
set_instance_parameter_value pcie pf2_bar5_size_hwtcl 12
set_instance_parameter_value pcie pf2_class_code_hwtcl 0
set_instance_parameter_value pcie pf2_device_id_hwtcl 0
set_instance_parameter_value pcie pf2_exprom_bar_present_hwtcl 0
set_instance_parameter_value pcie pf2_exprom_bar_size_hwtcl 12
set_instance_parameter_value pcie pf2_interrupt_pin_hwtcl inta
set_instance_parameter_value pcie pf2_intr_line_hwtcl 0
set_instance_parameter_value pcie pf2_msi_multi_message_capable_hwtcl 4
set_instance_parameter_value pcie pf2_msix_pba_bir_hwtcl 0
set_instance_parameter_value pcie pf2_msix_pba_offset_hwtcl 0
set_instance_parameter_value pcie pf2_msix_table_bir_hwtcl 0
set_instance_parameter_value pcie pf2_msix_table_offset_hwtcl 0
set_instance_parameter_value pcie pf2_msix_table_size_hwtcl 0
set_instance_parameter_value pcie pf2_pci_prog_intfc_byte_hwtcl 0
set_instance_parameter_value pcie pf2_revision_id_hwtcl 0
set_instance_parameter_value pcie pf2_subclass_code_hwtcl 0
set_instance_parameter_value pcie pf2_subsystem_device_id_hwtcl 0
set_instance_parameter_value pcie pf2_subsystem_vendor_id_hwtcl 0
set_instance_parameter_value pcie pf2_tph_dev_specific_mode_support_hwtcl 0
set_instance_parameter_value pcie pf2_tph_int_mode_support_hwtcl 0
set_instance_parameter_value pcie pf2_tph_st_table_location_hwtcl 0
set_instance_parameter_value pcie pf2_tph_st_table_size_hwtcl 63
set_instance_parameter_value pcie pf2_vendor_id_hwtcl 0
set_instance_parameter_value pcie pf2_vf_bar0_prefetchable_hwtcl 1
set_instance_parameter_value pcie pf2_vf_bar0_present_hwtcl 0
set_instance_parameter_value pcie pf2_vf_bar0_size_hwtcl 12
set_instance_parameter_value pcie pf2_vf_bar0_type_hwtcl 1
set_instance_parameter_value pcie pf2_vf_bar1_prefetchable_hwtcl 1
set_instance_parameter_value pcie pf2_vf_bar1_present_hwtcl 0
set_instance_parameter_value pcie pf2_vf_bar1_size_hwtcl 12
set_instance_parameter_value pcie pf2_vf_bar2_prefetchable_hwtcl 1
set_instance_parameter_value pcie pf2_vf_bar2_present_hwtcl 0
set_instance_parameter_value pcie pf2_vf_bar2_size_hwtcl 12
set_instance_parameter_value pcie pf2_vf_bar2_type_hwtcl 1
set_instance_parameter_value pcie pf2_vf_bar3_prefetchable_hwtcl 1
set_instance_parameter_value pcie pf2_vf_bar3_present_hwtcl 0
set_instance_parameter_value pcie pf2_vf_bar3_size_hwtcl 12
set_instance_parameter_value pcie pf2_vf_bar4_prefetchable_hwtcl 1
set_instance_parameter_value pcie pf2_vf_bar4_present_hwtcl 0
set_instance_parameter_value pcie pf2_vf_bar4_size_hwtcl 12
set_instance_parameter_value pcie pf2_vf_bar4_type_hwtcl 1
set_instance_parameter_value pcie pf2_vf_bar5_prefetchable_hwtcl 1
set_instance_parameter_value pcie pf2_vf_bar5_present_hwtcl 0
set_instance_parameter_value pcie pf2_vf_bar5_size_hwtcl 12
set_instance_parameter_value pcie pf2_vf_count_user_hwtcl 0
set_instance_parameter_value pcie pf2_vf_device_id_hwtcl 0
set_instance_parameter_value pcie pf2_vf_msix_pba_bir_hwtcl 0
set_instance_parameter_value pcie pf2_vf_msix_pba_offset_hwtcl 0
set_instance_parameter_value pcie pf2_vf_msix_tbl_bir_hwtcl 0
set_instance_parameter_value pcie pf2_vf_msix_tbl_offset_hwtcl 0
set_instance_parameter_value pcie pf2_vf_msix_tbl_size_hwtcl 0
set_instance_parameter_value pcie pf2_vf_subsystem_device_id_hwtcl 0
set_instance_parameter_value pcie pf2_vf_tph_dev_specific_mode_support_hwtcl 0
set_instance_parameter_value pcie pf2_vf_tph_int_mode_support_hwtcl 0
set_instance_parameter_value pcie pf2_vf_tph_st_table_location_hwtcl 0
set_instance_parameter_value pcie pf2_vf_tph_st_table_size_hwtcl 63
set_instance_parameter_value pcie pf2_virtio_capability_present_hwtcl 0
set_instance_parameter_value pcie pf2_virtio_cmn_config_bar_indicator_hwtcl 0
set_instance_parameter_value pcie pf2_virtio_cmn_config_bar_offset_hwtcl 0
set_instance_parameter_value pcie pf2_virtio_cmn_config_structure_length_hwtcl 0
set_instance_parameter_value pcie pf2_virtio_device_specific_cap_present_hwtcl 0
set_instance_parameter_value pcie pf2_virtio_devspecific_bar_indicator_hwtcl 0
set_instance_parameter_value pcie pf2_virtio_devspecific_bar_offset_hwtcl 0
set_instance_parameter_value pcie pf2_virtio_devspecific_structure_length_hwtcl 0
set_instance_parameter_value pcie pf2_virtio_isrstatus_bar_indicator_hwtcl 0
set_instance_parameter_value pcie pf2_virtio_isrstatus_bar_offset_hwtcl 0
set_instance_parameter_value pcie pf2_virtio_isrstatus_structure_length_hwtcl 0
set_instance_parameter_value pcie pf2_virtio_notification_bar_indicator_hwtcl 0
set_instance_parameter_value pcie pf2_virtio_notification_bar_offset_hwtcl 0
set_instance_parameter_value pcie pf2_virtio_notification_structure_length_hwtcl 0
set_instance_parameter_value pcie pf2_virtio_notify_off_multiplier_hwtcl 0
set_instance_parameter_value pcie pf2_virtio_pciconfig_access_bar_indicator_hwtcl 0
set_instance_parameter_value pcie pf2_virtio_pciconfig_access_bar_offset_hwtcl 0
set_instance_parameter_value pcie pf2_virtio_pciconfig_access_structure_length_hwtcl 0
set_instance_parameter_value pcie pf2vf_virtio_capability_present_hwtcl 0
set_instance_parameter_value pcie pf2vf_virtio_cmn_config_bar_indicator_hwtcl 0
set_instance_parameter_value pcie pf2vf_virtio_cmn_config_bar_offset_hwtcl 0
set_instance_parameter_value pcie pf2vf_virtio_cmn_config_structure_length_hwtcl 0
set_instance_parameter_value pcie pf2vf_virtio_device_specific_cap_present_hwtcl 0
set_instance_parameter_value pcie pf2vf_virtio_devspecific_bar_indicator_hwtcl 0
set_instance_parameter_value pcie pf2vf_virtio_devspecific_bar_offset_hwtcl 0
set_instance_parameter_value pcie pf2vf_virtio_devspecific_structure_length_hwtcl 0
set_instance_parameter_value pcie pf2vf_virtio_isrstatus_bar_indicator_hwtcl 0
set_instance_parameter_value pcie pf2vf_virtio_isrstatus_bar_offset_hwtcl 0
set_instance_parameter_value pcie pf2vf_virtio_isrstatus_structure_length_hwtcl 0
set_instance_parameter_value pcie pf2vf_virtio_notification_bar_indicator_hwtcl 0
set_instance_parameter_value pcie pf2vf_virtio_notification_bar_offset_hwtcl 0
set_instance_parameter_value pcie pf2vf_virtio_notification_structure_length_hwtcl 0
set_instance_parameter_value pcie pf2vf_virtio_notify_off_multiplier_hwtcl 0
set_instance_parameter_value pcie pf2vf_virtio_pciconfig_access_bar_indicator_hwtcl 0
set_instance_parameter_value pcie pf2vf_virtio_pciconfig_access_bar_offset_hwtcl 0
set_instance_parameter_value pcie pf2vf_virtio_pciconfig_access_structure_length_hwtcl 0
set_instance_parameter_value pcie pf3_ats_invalidate_queue_depth_hwtcl 0
set_instance_parameter_value pcie pf3_bar0_prefetchable_hwtcl 1
set_instance_parameter_value pcie pf3_bar0_present_hwtcl 0
set_instance_parameter_value pcie pf3_bar0_size_hwtcl 12
set_instance_parameter_value pcie pf3_bar0_type_hwtcl 1
set_instance_parameter_value pcie pf3_bar1_prefetchable_hwtcl 1
set_instance_parameter_value pcie pf3_bar1_present_hwtcl 0
set_instance_parameter_value pcie pf3_bar1_size_hwtcl 12
set_instance_parameter_value pcie pf3_bar2_prefetchable_hwtcl 1
set_instance_parameter_value pcie pf3_bar2_present_hwtcl 0
set_instance_parameter_value pcie pf3_bar2_size_hwtcl 12
set_instance_parameter_value pcie pf3_bar2_type_hwtcl 1
set_instance_parameter_value pcie pf3_bar3_prefetchable_hwtcl 1
set_instance_parameter_value pcie pf3_bar3_present_hwtcl 0
set_instance_parameter_value pcie pf3_bar3_size_hwtcl 12
set_instance_parameter_value pcie pf3_bar4_prefetchable_hwtcl 1
set_instance_parameter_value pcie pf3_bar4_present_hwtcl 0
set_instance_parameter_value pcie pf3_bar4_size_hwtcl 12
set_instance_parameter_value pcie pf3_bar4_type_hwtcl 1
set_instance_parameter_value pcie pf3_bar5_prefetchable_hwtcl 1
set_instance_parameter_value pcie pf3_bar5_present_hwtcl 0
set_instance_parameter_value pcie pf3_bar5_size_hwtcl 12
set_instance_parameter_value pcie pf3_class_code_hwtcl 0
set_instance_parameter_value pcie pf3_device_id_hwtcl 0
set_instance_parameter_value pcie pf3_exprom_bar_present_hwtcl 0
set_instance_parameter_value pcie pf3_exprom_bar_size_hwtcl 12
set_instance_parameter_value pcie pf3_interrupt_pin_hwtcl inta
set_instance_parameter_value pcie pf3_intr_line_hwtcl 0
set_instance_parameter_value pcie pf3_msi_multi_message_capable_hwtcl 4
set_instance_parameter_value pcie pf3_msix_pba_bir_hwtcl 0
set_instance_parameter_value pcie pf3_msix_pba_offset_hwtcl 0
set_instance_parameter_value pcie pf3_msix_table_bir_hwtcl 0
set_instance_parameter_value pcie pf3_msix_table_offset_hwtcl 0
set_instance_parameter_value pcie pf3_msix_table_size_hwtcl 0
set_instance_parameter_value pcie pf3_pci_prog_intfc_byte_hwtcl 0
set_instance_parameter_value pcie pf3_revision_id_hwtcl 0
set_instance_parameter_value pcie pf3_subclass_code_hwtcl 0
set_instance_parameter_value pcie pf3_subsystem_device_id_hwtcl 0
set_instance_parameter_value pcie pf3_subsystem_vendor_id_hwtcl 0
set_instance_parameter_value pcie pf3_tph_dev_specific_mode_support_hwtcl 0
set_instance_parameter_value pcie pf3_tph_int_mode_support_hwtcl 0
set_instance_parameter_value pcie pf3_tph_st_table_location_hwtcl 0
set_instance_parameter_value pcie pf3_tph_st_table_size_hwtcl 63
set_instance_parameter_value pcie pf3_vendor_id_hwtcl 0
set_instance_parameter_value pcie pf3_vf_bar0_prefetchable_hwtcl 1
set_instance_parameter_value pcie pf3_vf_bar0_present_hwtcl 0
set_instance_parameter_value pcie pf3_vf_bar0_size_hwtcl 12
set_instance_parameter_value pcie pf3_vf_bar0_type_hwtcl 1
set_instance_parameter_value pcie pf3_vf_bar1_prefetchable_hwtcl 1
set_instance_parameter_value pcie pf3_vf_bar1_present_hwtcl 0
set_instance_parameter_value pcie pf3_vf_bar1_size_hwtcl 12
set_instance_parameter_value pcie pf3_vf_bar2_prefetchable_hwtcl 1
set_instance_parameter_value pcie pf3_vf_bar2_present_hwtcl 0
set_instance_parameter_value pcie pf3_vf_bar2_size_hwtcl 12
set_instance_parameter_value pcie pf3_vf_bar2_type_hwtcl 1
set_instance_parameter_value pcie pf3_vf_bar3_prefetchable_hwtcl 1
set_instance_parameter_value pcie pf3_vf_bar3_present_hwtcl 0
set_instance_parameter_value pcie pf3_vf_bar3_size_hwtcl 12
set_instance_parameter_value pcie pf3_vf_bar4_prefetchable_hwtcl 1
set_instance_parameter_value pcie pf3_vf_bar4_present_hwtcl 0
set_instance_parameter_value pcie pf3_vf_bar4_size_hwtcl 12
set_instance_parameter_value pcie pf3_vf_bar4_type_hwtcl 1
set_instance_parameter_value pcie pf3_vf_bar5_prefetchable_hwtcl 1
set_instance_parameter_value pcie pf3_vf_bar5_present_hwtcl 0
set_instance_parameter_value pcie pf3_vf_bar5_size_hwtcl 12
set_instance_parameter_value pcie pf3_vf_count_user_hwtcl 0
set_instance_parameter_value pcie pf3_vf_device_id_hwtcl 0
set_instance_parameter_value pcie pf3_vf_msix_pba_bir_hwtcl 0
set_instance_parameter_value pcie pf3_vf_msix_pba_offset_hwtcl 0
set_instance_parameter_value pcie pf3_vf_msix_tbl_bir_hwtcl 0
set_instance_parameter_value pcie pf3_vf_msix_tbl_offset_hwtcl 0
set_instance_parameter_value pcie pf3_vf_msix_tbl_size_hwtcl 0
set_instance_parameter_value pcie pf3_vf_subsystem_device_id_hwtcl 0
set_instance_parameter_value pcie pf3_vf_tph_dev_specific_mode_support_hwtcl 0
set_instance_parameter_value pcie pf3_vf_tph_int_mode_support_hwtcl 0
set_instance_parameter_value pcie pf3_vf_tph_st_table_location_hwtcl 0
set_instance_parameter_value pcie pf3_vf_tph_st_table_size_hwtcl 63
set_instance_parameter_value pcie pf3_virtio_capability_present_hwtcl 0
set_instance_parameter_value pcie pf3_virtio_cmn_config_bar_indicator_hwtcl 0
set_instance_parameter_value pcie pf3_virtio_cmn_config_bar_offset_hwtcl 0
set_instance_parameter_value pcie pf3_virtio_cmn_config_structure_length_hwtcl 0
set_instance_parameter_value pcie pf3_virtio_device_specific_cap_present_hwtcl 0
set_instance_parameter_value pcie pf3_virtio_devspecific_bar_indicator_hwtcl 0
set_instance_parameter_value pcie pf3_virtio_devspecific_bar_offset_hwtcl 0
set_instance_parameter_value pcie pf3_virtio_devspecific_structure_length_hwtcl 0
set_instance_parameter_value pcie pf3_virtio_isrstatus_bar_indicator_hwtcl 0
set_instance_parameter_value pcie pf3_virtio_isrstatus_bar_offset_hwtcl 0
set_instance_parameter_value pcie pf3_virtio_isrstatus_structure_length_hwtcl 0
set_instance_parameter_value pcie pf3_virtio_notification_bar_indicator_hwtcl 0
set_instance_parameter_value pcie pf3_virtio_notification_bar_offset_hwtcl 0
set_instance_parameter_value pcie pf3_virtio_notification_structure_length_hwtcl 0
set_instance_parameter_value pcie pf3_virtio_notify_off_multiplier_hwtcl 0
set_instance_parameter_value pcie pf3_virtio_pciconfig_access_bar_indicator_hwtcl 0
set_instance_parameter_value pcie pf3_virtio_pciconfig_access_bar_offset_hwtcl 0
set_instance_parameter_value pcie pf3_virtio_pciconfig_access_structure_length_hwtcl 0
set_instance_parameter_value pcie pf3vf_virtio_capability_present_hwtcl 0
set_instance_parameter_value pcie pf3vf_virtio_cmn_config_bar_indicator_hwtcl 0
set_instance_parameter_value pcie pf3vf_virtio_cmn_config_bar_offset_hwtcl 0
set_instance_parameter_value pcie pf3vf_virtio_cmn_config_structure_length_hwtcl 0
set_instance_parameter_value pcie pf3vf_virtio_device_specific_cap_present_hwtcl 0
set_instance_parameter_value pcie pf3vf_virtio_devspecific_bar_indicator_hwtcl 0
set_instance_parameter_value pcie pf3vf_virtio_devspecific_bar_offset_hwtcl 0
set_instance_parameter_value pcie pf3vf_virtio_devspecific_structure_length_hwtcl 0
set_instance_parameter_value pcie pf3vf_virtio_isrstatus_bar_indicator_hwtcl 0
set_instance_parameter_value pcie pf3vf_virtio_isrstatus_bar_offset_hwtcl 0
set_instance_parameter_value pcie pf3vf_virtio_isrstatus_structure_length_hwtcl 0
set_instance_parameter_value pcie pf3vf_virtio_notification_bar_indicator_hwtcl 0
set_instance_parameter_value pcie pf3vf_virtio_notification_bar_offset_hwtcl 0
set_instance_parameter_value pcie pf3vf_virtio_notification_structure_length_hwtcl 0
set_instance_parameter_value pcie pf3vf_virtio_notify_off_multiplier_hwtcl 0
set_instance_parameter_value pcie pf3vf_virtio_pciconfig_access_bar_indicator_hwtcl 0
